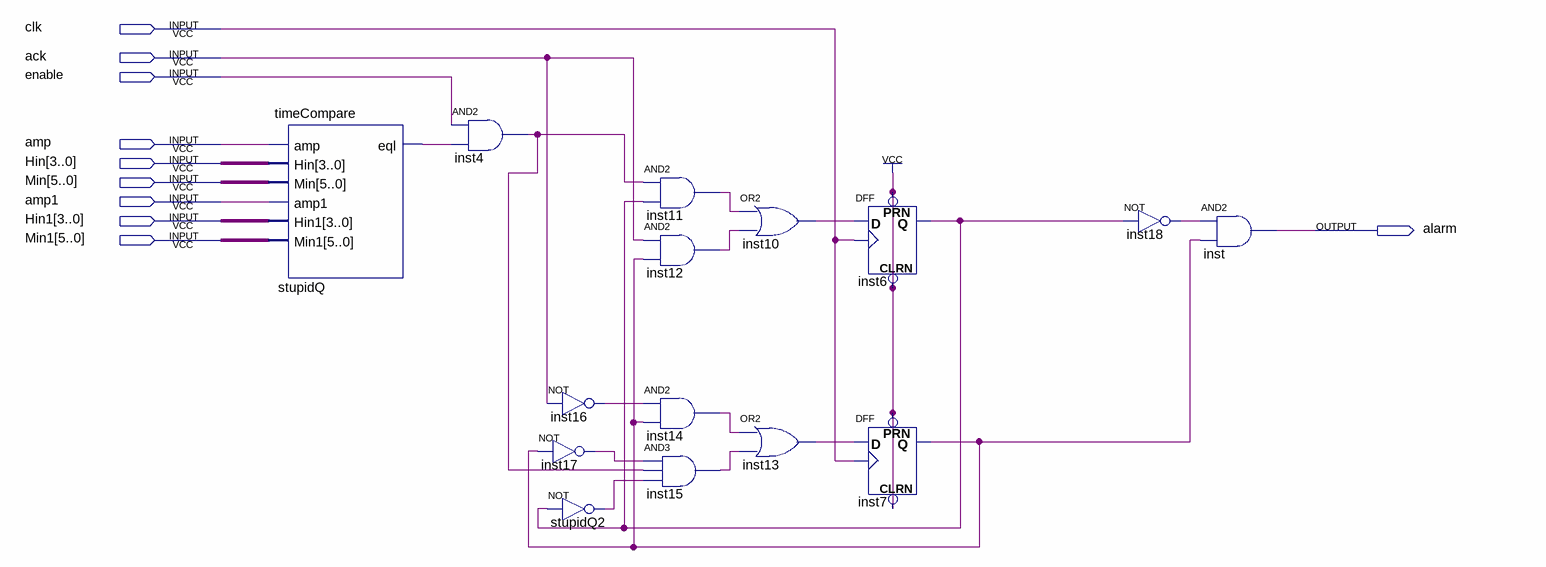
[diagram p0: schematic sheet]
// Quartus schematic alarmFSM.bdf as structural Verilog: 15 symbols, 10 pins
module alarmFSM (
  input  clk,
  input  ack,
  input  enable,
  input  amp,
  input  [3:0] Hin,
  input  [5:0] Min,
  input  amp1,
  input  [3:0] Hin1,
  input  [5:0] Min1,
  output alarm
);

  wire inst4_out, inst6_q, inst7_q, inst10_out, inst11_out, inst12_out, inst13_out, inst14_out, inst15_out,
       inst16_out, inst17_out, inst18_out, stupidQ2_out, stupidQ_eql;

  timeCompare stupidQ (.amp(amp), .Hin(Hin), .Min(Min), .amp1(amp1), .Hin1(Hin1), .Min1(Min1), .eql(stupidQ_eql));
  and inst4 (inst4_out, enable, stupidQ_eql);
  not inst16 (inst16_out, ack);
  not inst17 (inst17_out, inst7_q);
  not stupidQ2 (stupidQ2_out, inst6_q);
  and inst11 (inst11_out, inst4_out, inst6_q);
  and inst12 (inst12_out, ack, inst7_q);
  and inst14 (inst14_out, inst16_out, inst7_q);
  and inst15 (inst15_out, inst17_out, inst4_out, stupidQ2_out);
  or inst10 (inst10_out, inst11_out, inst12_out);
  or inst13 (inst13_out, inst14_out, inst15_out);
  DFF inst6 (.CLRN(1'b1), .CLK(clk), .D(inst10_out), .PRN(1'b1), .Q(inst6_q));
  DFF inst7 (.CLRN(1'b1), .CLK(clk), .D(inst13_out), .PRN(1'b1), .Q(inst7_q));
  not inst18 (inst18_out, inst6_q);
  and inst (alarm, inst18_out, inst7_q);
endmodule
